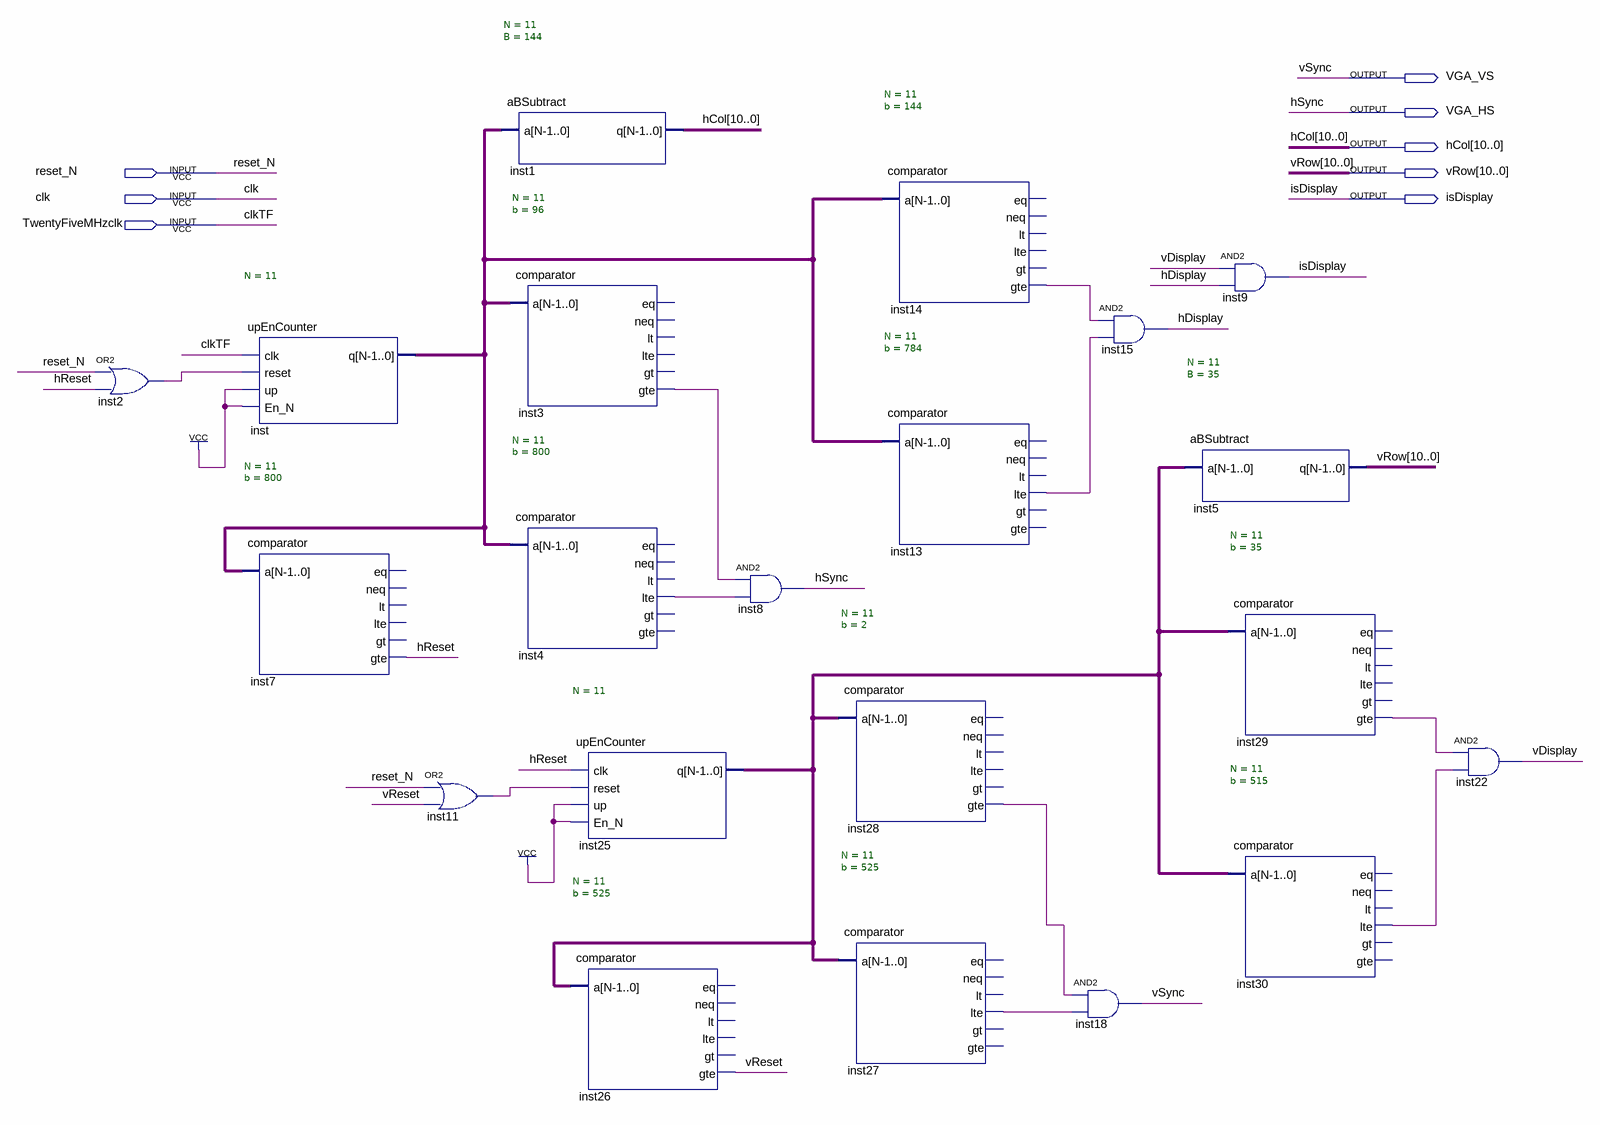
[diagram p0: schematic sheet]
// Quartus schematic newVGAModule.bdf as structural Verilog: 21 symbols, 8 pins
module newVGAModule (
  input  reset_N,
  input  clk,
  input  TwentyFiveMHzclk,
  output VGA_VS,
  output VGA_HS,
  output [10:0] hCol,
  output [10:0] vRow,
  output isDisplay
);

  wire hDisplay, hReset, inst2_out, inst3_gte, inst4_lte, inst11_out, inst13_lte, inst14_gte, inst27_lte,
       inst28_gte, inst29_gte, inst30_lte, vDisplay, vReset;
  wire [10:0] inst25_q, inst_q;

  or inst2 (inst2_out, reset_N, hReset);
  upEnCounter #(.N(11)) inst (.clk(TwentyFiveMHzclk), .reset(inst2_out), .up(1'b1), .En_N(1'b1), .q(inst_q));
  comparator #(.N(11), .b(800)) inst7 (.a(inst_q), .gte(hReset));  // open: eq, neq, lt, lte, gt
  or inst11 (inst11_out, reset_N, vReset);
  aBSubtract #(.N(11), .B(144)) inst1 (.a(inst_q), .q(hCol));
  comparator #(.N(11), .b(96)) inst3 (.a(inst_q), .gte(inst3_gte));  // open: eq, neq, lt, lte, gt
  comparator #(.N(11), .b(800)) inst4 (.a(inst_q), .lte(inst4_lte));  // open: eq, neq, lt, gt, gte
  upEnCounter #(.N(11)) inst25 (.clk(hReset), .reset(inst11_out), .up(1'b1), .En_N(1'b1), .q(inst25_q));
  comparator #(.N(11), .b(525)) inst26 (.a(inst25_q), .gte(vReset));  // open: eq, neq, lt, lte, gt
  and inst8 (VGA_HS, inst3_gte, inst4_lte);
  comparator #(.N(11), .b(2)) inst28 (.a(inst25_q), .gte(inst28_gte));  // open: eq, neq, lt, lte, gt
  comparator #(.N(11), .b(525)) inst27 (.a(inst25_q), .lte(inst27_lte));  // open: eq, neq, lt, gt, gte
  comparator #(.N(11), .b(144)) inst14 (.a(inst_q), .gte(inst14_gte));  // open: eq, neq, lt, lte, gt
  comparator #(.N(11), .b(784)) inst13 (.a(inst_q), .lte(inst13_lte));  // open: eq, neq, lt, gt, gte
  and inst15 (hDisplay, inst14_gte, inst13_lte);
  and inst18 (VGA_VS, inst28_gte, inst27_lte);
  aBSubtract #(.N(11), .B(35)) inst5 (.a(inst25_q), .q(vRow));
  and inst9 (isDisplay, vDisplay, hDisplay);
  comparator #(.N(11), .b(35)) inst29 (.a(inst25_q), .gte(inst29_gte));  // open: eq, neq, lt, lte, gt
  comparator #(.N(11), .b(515)) inst30 (.a(inst25_q), .lte(inst30_lte));  // open: eq, neq, lt, gt, gte
  and inst22 (vDisplay, inst29_gte, inst30_lte);

  // Other names for the same wires on the sheet: clkTF = TwentyFiveMHzclk; hSync = VGA_HS; vSync = VGA_VS
endmodule
